# Altium schematic sheet MB1-USB-r1.0.SchDoc: USB2Com & USB Native
size A; DrawnBy: MBoard team; DocumentNumber: 3; Revision: 1.1; SheetNumber: 3; SheetTotal: 7
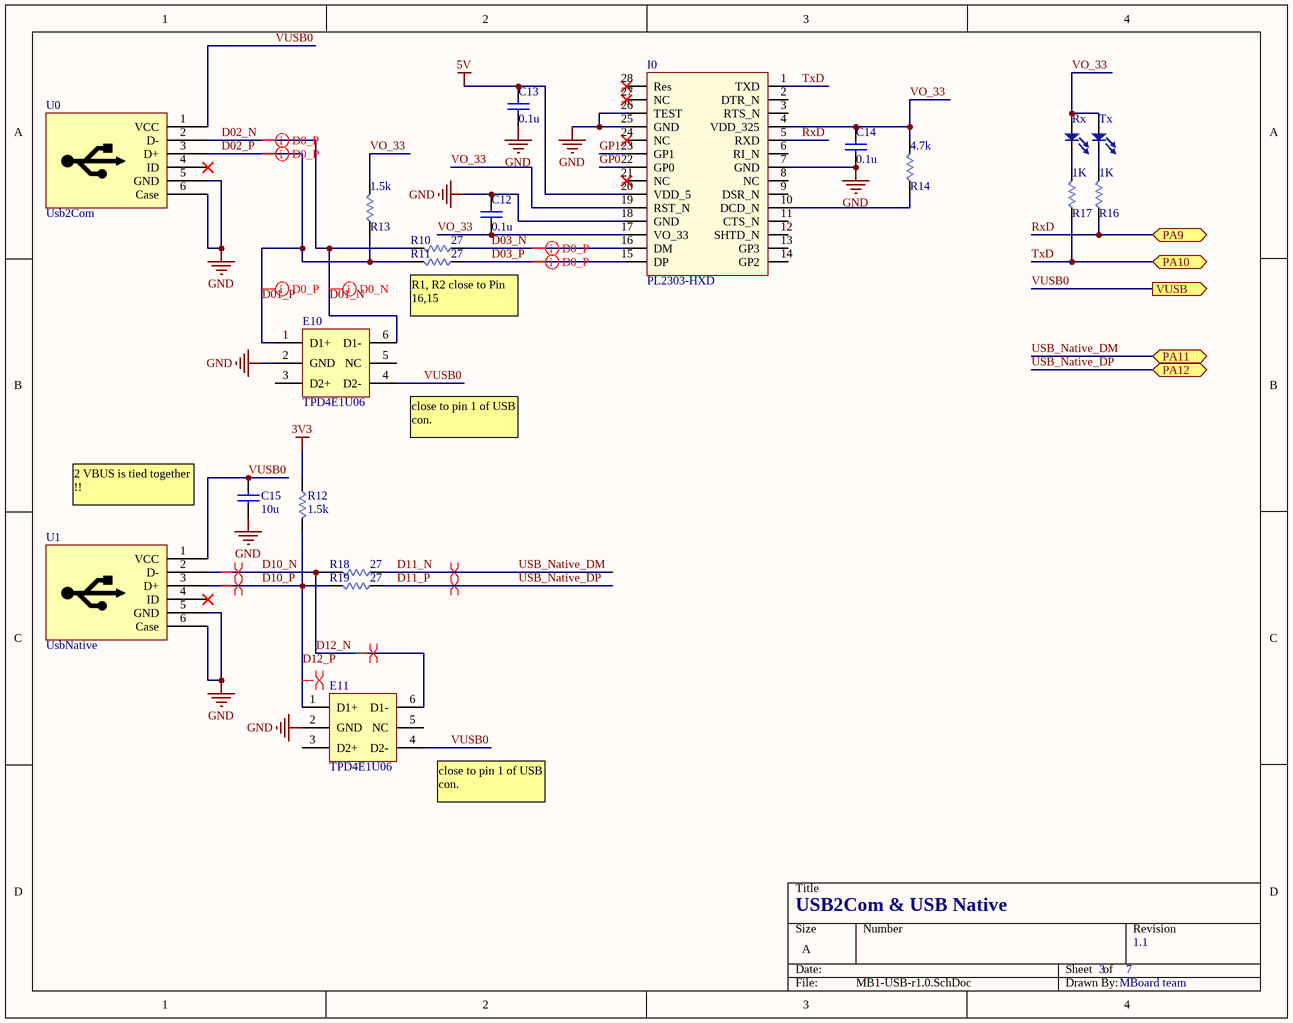
[diagram p0: MB1-USB-r1.0.SchDoc]

## Parts
C12  value 0.1u  [SM_0805_LD]  (hidden comment: CAP Ceramic)
C13  value 0.1u  [SM_0805_LD]  (hidden comment: CAP Ceramic)
C14  value 0.1u  [SM_0805_LD]  (hidden comment: CAP Ceramic)
C15  value 10u  [SM_0805_LD]  (hidden comment: CAP Ceramic)
E10  TPD4E1U06  [SC70-6]
E11  TPD4E1U06  [SC70-6]
I0  PL2303-HXD  [SSOP-28]
R10  value 27  [SM_0805_LD]
R11  value 27  [SM_0805_LD]
R12  value 1.5k  [SM_0805_LD]
R13  value 1.5k  [SM_0805_LD]
R14  value 4.7k  [SM_0805_LD]
R16  value 1K  [SM_0805_LD]
R17  value 1K  [SM_0805_LD]
R18  value 27  [SM_0805_LD]
R19  value 27  [SM_0805_LD]
Rx  Blue  [SM_0805_POL_LD]  (value not drawn)
Tx  Green  [SM_0805_POL_LD]  (value not drawn)
U0  Usb2Com  [USB-mini-B]
U1  UsbNative  [USB-mini-B]

## Ports
PA9 (bidir), PA10 (bidir), PA11 (bidir), PA12 (bidir), VUSB (out)

## Nets
3V3: R12.1
5V: C13.2 I0.20(VDD_5)
GND: C12.2 C13.1 C14.1 C15.1 E10.2(GND) E11.2(GND) I0.7(GND) I0.18(GND) I0.25(GND) I0.26(TEST) U0.5(GND) U0.6(Case) U1.5(GND) U1.6(Case)
D01_N: E10.6(D1-) R10.2 U0.2(D-)  [also labelled D02_N]
D01_P: E10.1(D1+) R11.2 R13.1 U0.3(D+)  [also labelled D02_P]
D03_N: I0.16(DM) R10.1
D03_P: I0.15(DP) R11.1
D10_N: E11.6(D1-) R18.2 U1.2(D-)  [also labelled D12_N]
D10_P: E11.1(D1+) R12.2 R19.2 U1.3(D+)  [also labelled D12_P]
D11_N: R18.1 ; port PA11  [also labelled USB_Native_DM]
D11_P: R19.1 ; port PA12  [also labelled USB_Native_DP]
GP0: I0.22(GP0)
GP1: I0.23(GP1)
RxD: I0.5(RXD) R16.1 ; port PA9
TxD: I0.1(TXD) R17.1 ; port PA10
VO_33: C12.1 C14.2 I0.4(VDD_325) I0.17(VO_33) I0.19(RST_N) R13.2 R14.2 Rx.1(A) Tx.1(A)
VUSB0: C15.2 E10.4(D2-) E11.4(D2-) U0.1(VCC) U1.1(VCC) ; port VUSB
NetI0_10: I0.10(DCD_N) R14.1
NetR16_2: R16.2 Tx.2(K)
NetR17_2: R17.2 Rx.2(K)

Not connected (* = marked no-connect by the designer): E10 3(D2+) 5(NC); E11 3(D2+) 5(NC); I0 2(DTR_N) 3(RTS_N) 6(RI_N) 8(NC) 9(DSR_N) 11(CTS_N) 12(SHTD_N) 13(GP3) 14(GP2) 21(NC)* 24(NC)* 27(NC)* 28(Res)*; U0 4(ID)*; U1 4(ID)*

## Layout directives
differential pair: D01_N, D01_P, D03_N, D03_P, D10_N, D10_P, D11_N, D11_P

## Notes on the sheet
- (near R11) R1, R2 close to Pin 16,15
- (near E10) close to pin 1 of USB con.
- 2 VBUS is tied together !!
- (near E11) close to pin 1 of USB con.

## Library data of the parts
C12-C15 = CAP Ceramic: Non-polarity ceramic capacitor; Published: 8-Jun-2000; LatestRevisionDate: 17-Jul-2002; LatestRevisionNote: Re-released for DXP Platform.; PackageReference: RAD-0.3; Publisher: Altium Limited; PackageDescription: Radial Cap, Thru-Hole; 2 Leads; 0.3 in Pin Spacing
R10-R14 R16-R19 = R: Resistor; Published: 8-Jun-2000; LatestRevisionDate: 29-May-2009; LatestRevisionNote: IPC-7351 Footprint Added.; PackageReference: J1-0603; Publisher: Altium Limited; PackageDescription: Chip Resistor
Rx Tx = LED: Published: 8-Jun-2000; LatestRevisionDate: 08-Jul-2005; LatestRevisionNote: Mech Layer 1 removed.; PackageReference: LED-1; Publisher: Altium Limited; PackageDescription: LED; 2 Leads
U0 U1 = USB-Mini-B